# EAGLE design FindMe_Hub (EAGLE 9.0.1)

## Sheet 1 of 2
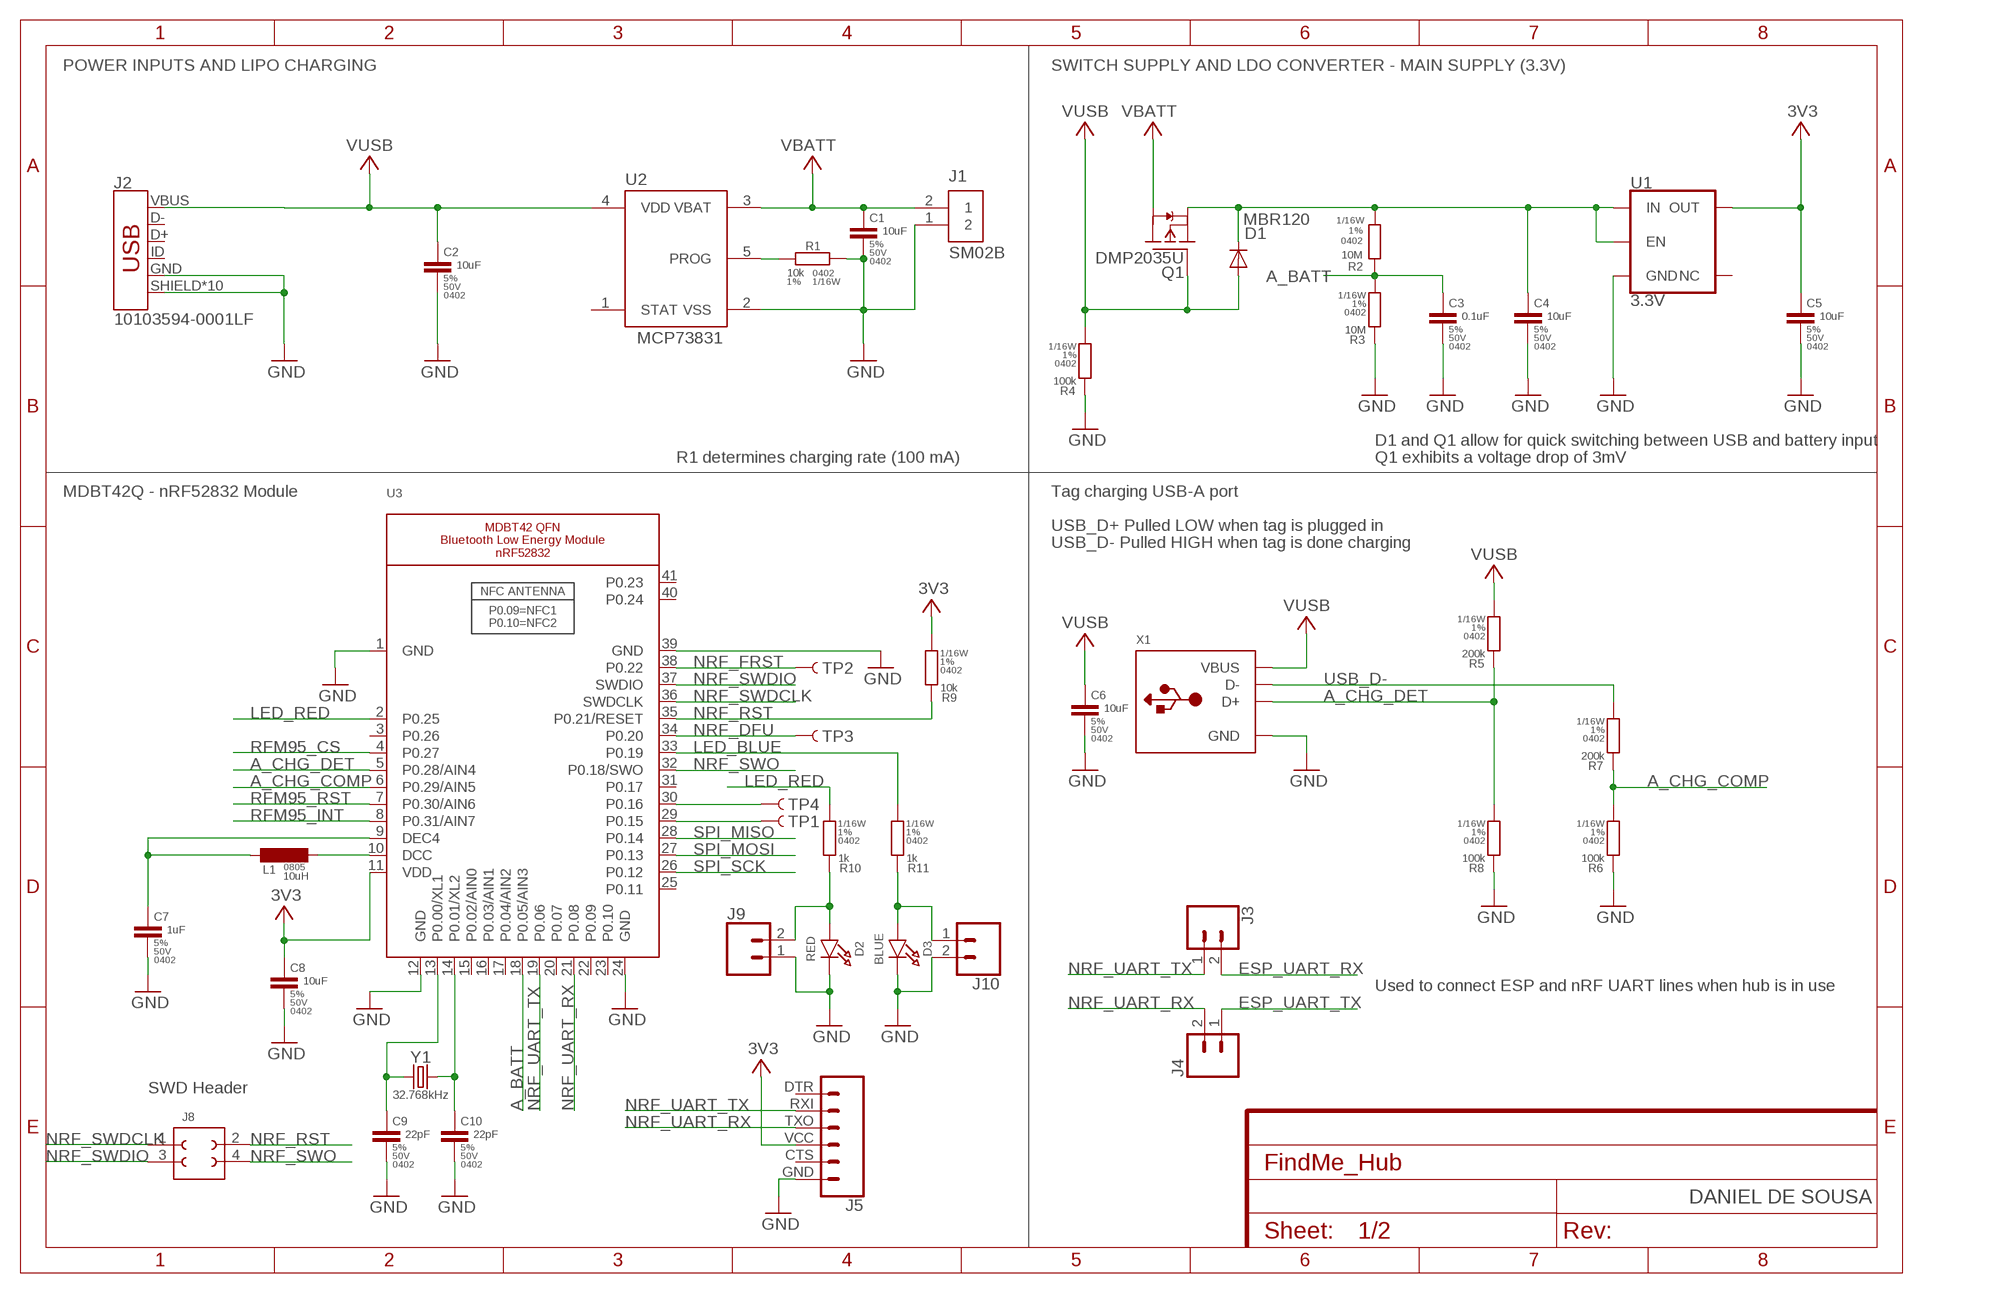
[diagram p0: schematic, sheet 1]

### Parts
C1  10uF  C-EUC0402_MURATA_GRM15-GJM15  [C0402_MURATA_GRM15-GJM15]
C2  10uF  C-EUC0402_MURATA_GRM15-GJM15  [C0402_MURATA_GRM15-GJM15]
C3  0.1uF  C-EUC0402_MURATA_GRM15-GJM15  [C0402_MURATA_GRM15-GJM15]
C4  10uF  C-EUC0402_MURATA_GRM15-GJM15  [C0402_MURATA_GRM15-GJM15]
C5  10uF  C-EUC0402_MURATA_GRM15-GJM15  [C0402_MURATA_GRM15-GJM15]
C6  10uF  C-EUC0402_MURATA_GRM15-GJM15  [C0402_MURATA_GRM15-GJM15]
C7  1uF  C-EUC0402_MURATA_GRM15-GJM15  [C0402_MURATA_GRM15-GJM15]
C8  10uF  C-EUC0402_MURATA_GRM15-GJM15  [C0402_MURATA_GRM15-GJM15]
C9  22pF  C-EUC0402_MURATA_GRM15-GJM15  [C0402_MURATA_GRM15-GJM15]
C10  22pF  C-EUC0402_MURATA_GRM15-GJM15  [C0402_MURATA_GRM15-GJM15]
D1  MBR120  AS-ITM-00111  [SOD-123FL]
D2  RED  LED0805_NOOUTLINE  [CHIPLED_0805_NOOUTLINE]
D3  BLUE  LED0805_NOOUTLINE  [CHIPLED_0805_NOOUTLINE]
J1  SM02B  AS-ITM-00231  [JST_SH_2X1]
J2  10103594-0001LF  USB_MICRO-B_HALF_PTH_MILL  [USB-MICROB-PTH-MILL]
J3  CONN_02  [1X02]
J4  CONN_02  [1X02]
J5  6_PIN_SERIAL_CABLEPTH  [FTDI_BASIC]
J8  610X0421121  [610X0421121]
J9  CONN_02  [1X02]
J10  CONN_02  [1X02]
L1  10uH  LQM21PN1R0MC0D  [L0805_MURATA_LQM21]
Q1  DMP2035U  AS-ITM-00024  [SOT23]
R1  10k  CRCW040210K0FKED  [R0402_VISHAY_CRCW0402]
R2  10M  CRCW04021M00FKED  [R0402_VISHAY_CRCW0402]
R3  10M  CRCW04021M00FKED  [R0402_VISHAY_CRCW0402]
R4  100k  CRCW04021M00FKED  [R0402_VISHAY_CRCW0402]
R5  200k  CRCW04021M00FKED  [R0402_VISHAY_CRCW0402]
R6  100k  CRCW04021M00FKED  [R0402_VISHAY_CRCW0402]
R7  200k  CRCW04021M00FKED  [R0402_VISHAY_CRCW0402]
R8  100k  CRCW04021M00FKED  [R0402_VISHAY_CRCW0402]
R9  10k  CRCW040210K0FKED  [R0402_VISHAY_CRCW0402]
R10  1k  CRCW040210K0FKED  [R0402_VISHAY_CRCW0402]
R11  1k  CRCW040210K0FKED  [R0402_VISHAY_CRCW0402]
TP1  TEST-POINT3X5  [PAD.03X.05]
TP2  TEST-POINT3X5  [PAD.03X.05]
TP3  TEST-POINT3X5  [PAD.03X.05]
TP4  TEST-POINT3X5  [PAD.03X.05]
U1  3.3V  V_REG_AP2112K-3.3V  [SOT23-5]
U2  MCP73831  AS-ITM-00136  [SOT-23]
U3  NRF52832_MODULE_MDBT42  [BLE_MODULE_RAYTAC_MDBT42]
X1  USB_TYPEAPTHFML  [USB_HOST-PTH]
Y1  32.768kHz  CRYSTAL-32.768KHZSMD-3.2X1.5  [CRYSTAL-SMD-3.2X1.5MM]

### Nets
+3V3: C5.1 C8.1 J5.VCC R9.2 U1.5(OUT) U3.11(VDD) ; supply symbol labelled 3V3 ; also sheet 2
A_BATT: C3.1 R2.1 R3.2 U3.18(P0.05/AIN3)
A_CHG_COMP: R6.2 R7.1 U3.6(P0.29/AIN5)
A_CHG_DET: R5.1 R8.2 U3.5(P0.28/AIN4) X1.D+
ESP_UART_RX: J3.2 ; also sheet 2
ESP_UART_TX: J4.1 ; also sheet 2
GND: C1.2 C2.2 C3.2 C4.2 C5.2 C6.2 C7.2 C8.2 C9.2 C10.2 D2.C D3.C J1.1 J2.GND J2.SHIELD J2.SHIELD2(SHIELD) J2.SHIELD3(SHIELD) J2.SHIELD4(SHIELD) J2.SHIELD5(SHIELD) J2.SHIELD6(SHIELD) J2.SHIELD7(SHIELD) J2.SHIELD8(SHIELD) J2.SHIELD9(SHIELD) J2.SHIELD10(SHIELD) J5.GND J9.1 J10.2 R1.1 R3.1 R4.1 R6.1 R8.1 U1.2(GND) U2.2(VSS) U3.1(GND) U3.12(GND) U3.24(GND) U3.39(GND) X1.GND ; also sheet 2
LED_BLUE: R11.2 U3.33(P0.19)
LED_RED: R10.2 U3.2(P0.25)
N$1: C9.1 U3.13(P0.00/XL1) Y1.P$1
N$2: R1.2 U2.5(PROG)
N$3: C4.1 D1.C Q1.E(S) R2.2 U1.1(IN) U1.3(EN)
N$4: C10.1 U3.14(P0.01/XL2) Y1.P$2
N$5: TP4.P$1 U3.30(P0.16)
N$6: TP1.P$1 U3.29(P0.15)
N$7: D2.A J9.2 R10.1
N$8: L1.P$2 U3.10(DCC)
N$9: C7.1 L1.P$1 U3.9(DEC4)
N$11: D3.A J10.1 R11.1
NRF_DFU: TP3.P$1 U3.34(P0.20)
NRF_FRST: TP2.P$1 U3.38(P0.22)
NRF_RST: J8.2 R9.1 U3.35(P0.21/RESET)
NRF_SWDCLK: J8.1 U3.36(SWDCLK)
NRF_SWDIO: J8.3 U3.37(SWDIO)
NRF_SWO: J8.4 U3.32(P0.18/SWO)
NRF_UART_RX: J4.2 J5.TXO U3.21(P0.08)
NRF_UART_TX: J3.1 J5.RXI U3.19(P0.06)
RFM95_CS: U3.4(P0.27) ; also sheet 2
RFM95_INT: U3.8(P0.31/AIN7) ; also sheet 2
RFM95_RST: U3.7(P0.30/AIN6) ; also sheet 2
SPI_MISO: U3.28(P0.14) ; also sheet 2
SPI_MOSI: U3.27(P0.13) ; also sheet 2
SPI_SCK: U3.26(P0.12) ; also sheet 2
USB_D-: R7.2 X1.D-
VBATT: C1.1 J1.2 Q1.C(D) U2.3(VBAT)
VUSB: C2.1 C6.1 D1.A J2.VBUS Q1.B(G) R4.2 R5.2 U2.4(VDD) X1.VBUS ; also sheet 2
Unconnected: J2.D+ J2.D- J2.ID J5.CTS J5.DTR U1.4(NC) U2.1(STAT) U3.3(P0.26) U3.15(P0.02/AIN0) U3.16(P0.03/AIN1) U3.17(P0.04/AIN2) U3.20(P0.07) U3.22(P0.09) U3.23(P0.10) U3.25(P0.11) U3.31(P0.17) U3.40(P0.24) U3.41(P0.23)

### Notes on the sheet
- POWER INPUTS AND LIPO CHARGING | SWITCH SUPPLY AND LDO CONVERTER - MAIN SUPPLY (3.3V)
- D1 and Q1 allow for quick switching between USB and battery input
- R1 determines charging rate (100 mA) | Q1 exhibits a voltage drop of 3mV
- MDBT42Q - nRF52832 Module | Tag charging USB-A port
- USB_D+ Pulled LOW when tag is plugged in
- USB_D- Pulled HIGH when tag is done charging
- Used to connect ESP and nRF UART lines when hub is in use
- SWD Header
- DANIEL DE SOUSA

## Sheet 2 of 2
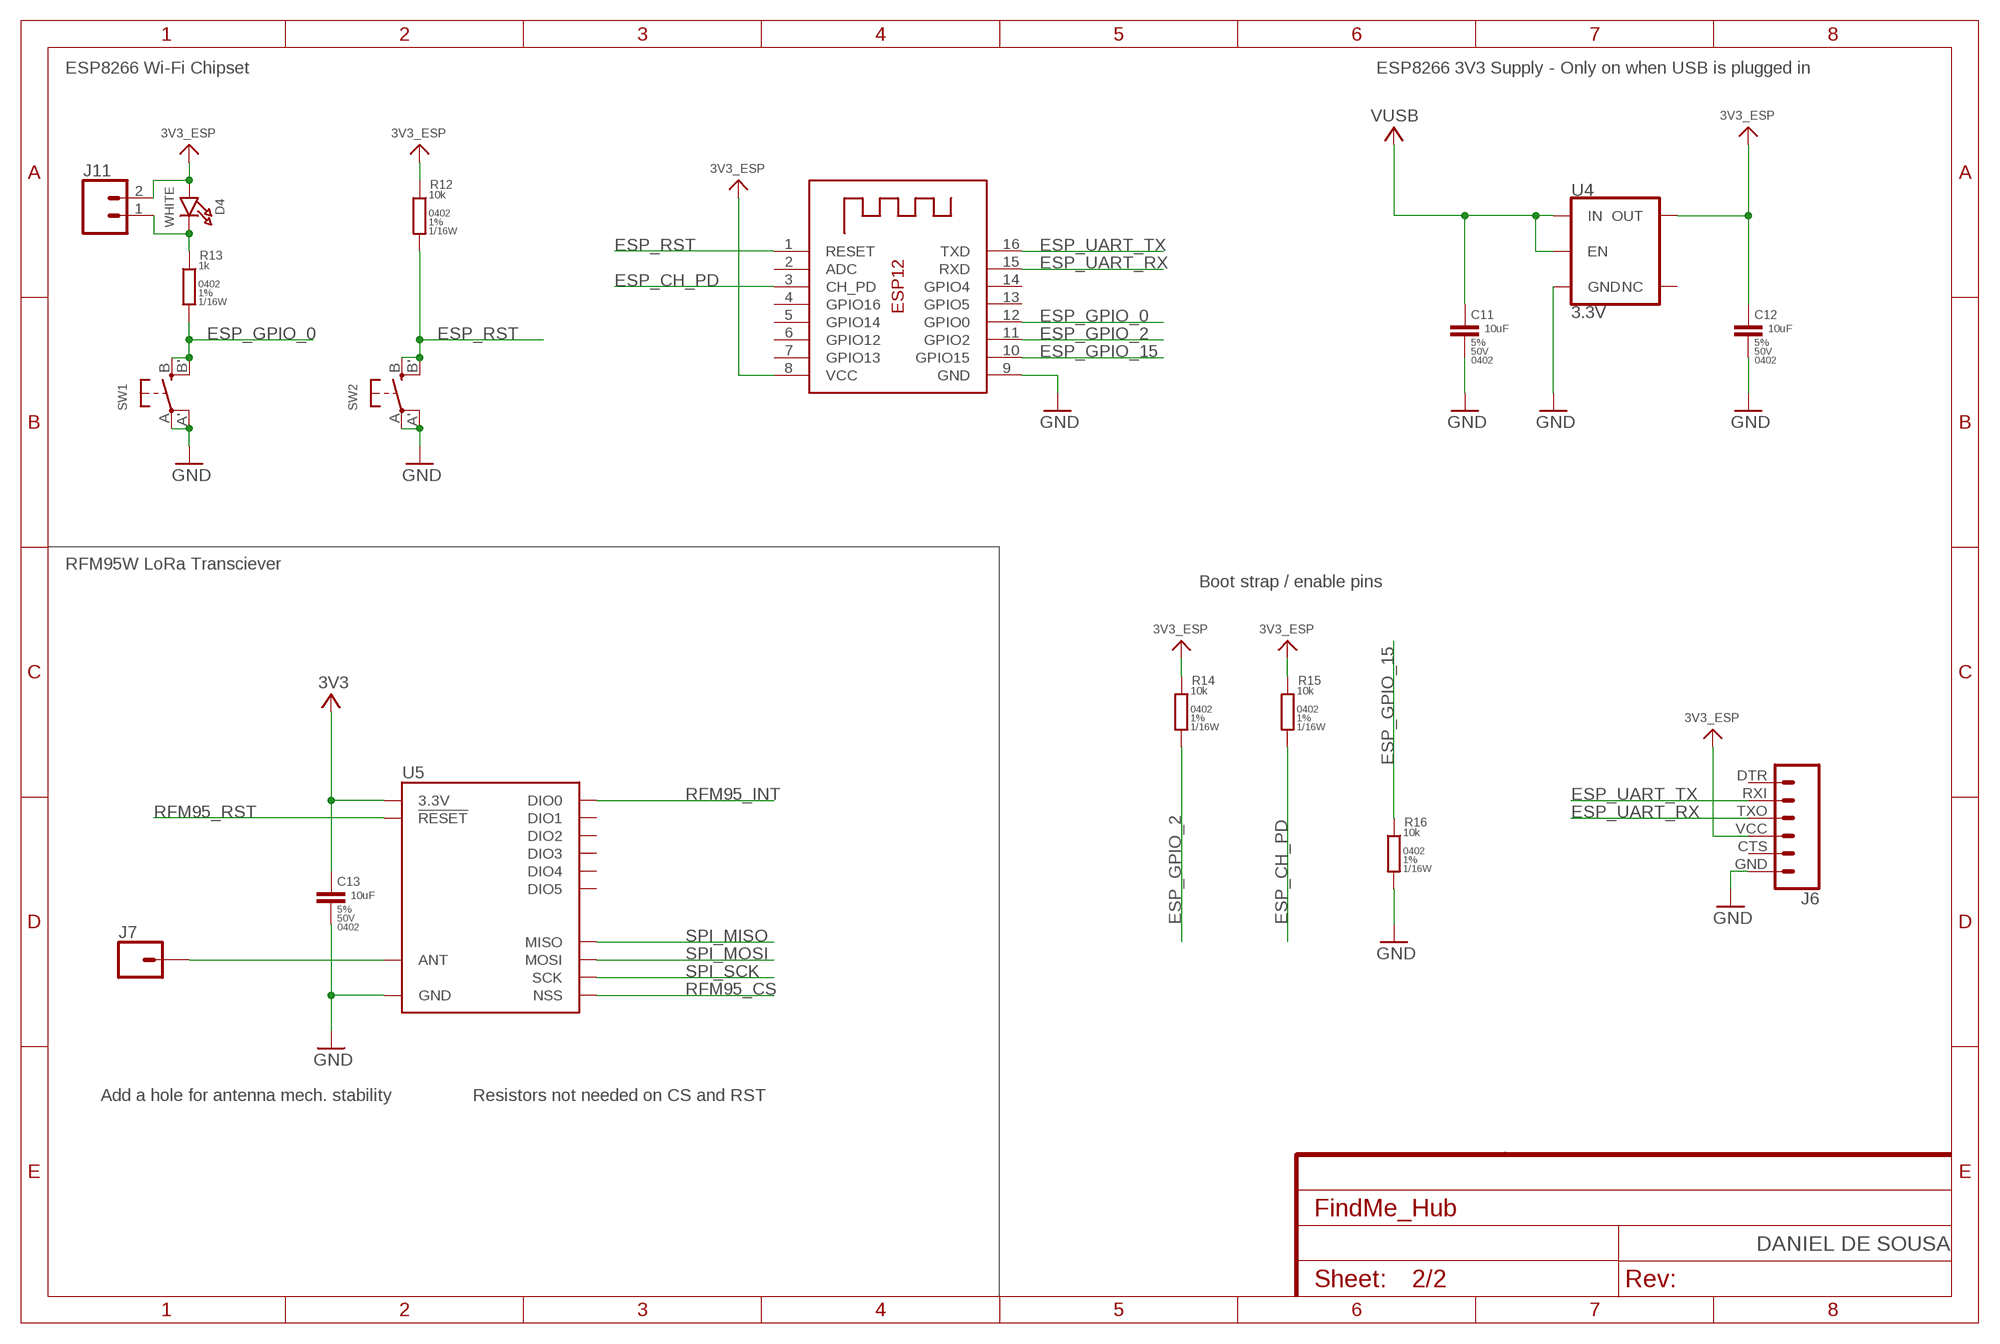
[diagram p1: schematic, sheet 2]

### Parts
C11  10uF  C-EUC0402_MURATA_GRM15-GJM15  [C0402_MURATA_GRM15-GJM15]
C12  10uF  C-EUC0402_MURATA_GRM15-GJM15  [C0402_MURATA_GRM15-GJM15]
C13  10uF  C-EUC0402_MURATA_GRM15-GJM15  [C0402_MURATA_GRM15-GJM15]
D4  WHITE  LED0805_NOOUTLINE  [CHIPLED_0805_NOOUTLINE]
J6  6_PIN_SERIAL_CABLEPTH  [FTDI_BASIC]
J7  CONN_01PTH_NO_SILK_YES_STOP  [1X01_NO_SILK]
J11  CONN_02  [1X02]
R12  10k  CRCW04021M00FKED  [R0402_VISHAY_CRCW0402]
R13  1k  CRCW04021M00FKED  [R0402_VISHAY_CRCW0402]
R14  10k  CRCW04021M00FKED  [R0402_VISHAY_CRCW0402]
R15  10k  CRCW04021M00FKED  [R0402_VISHAY_CRCW0402]
R16  10k  CRCW04021M00FKED  [R0402_VISHAY_CRCW0402]
SW1  SWITCH_TACT_SMT4.6X2.8  [BTN_KMR2_4.6X2.8]
SW2  SWITCH_TACT_SMT4.6X2.8  [BTN_KMR2_4.6X2.8]
U4  3.3V  V_REG_AP2112K-3.3V  [SOT23-5]
U5  RFM95W  [RFM95/96/97/98W]
X2  ESP-12  [ESP-12]

### Nets
+3V3: C13.1 U5.3.3V ; supply symbol labelled 3V3 ; also sheet 1
ESP_CH_PD: R15.2 X2.3(CH_PD)
ESP_GPIO_0: R13.2 SW1.B'(S1) SW1.B(S) X2.12(GPIO0)
ESP_GPIO_2: R14.2 X2.11(GPIO2)
ESP_GPIO_15: R16.1 X2.10(GPIO15)
ESP_RST: R12.2 SW2.B'(S1) SW2.B(S) X2.1(RESET)
ESP_UART_RX: J6.TXO X2.15(RXD) ; also sheet 1
ESP_UART_TX: J6.RXI X2.16(TXD) ; also sheet 1
GND: C11.2 C12.2 C13.2 J6.GND R16.2 SW1.A'(P1) SW1.A(P) SW2.A'(P1) SW2.A(P) U4.2(GND) U5.GND@1(GND) U5.GND@2(GND) U5.GND@3(GND) X2.9(GND) ; also sheet 1
N$12: J7.1 U5.ANT
N$14: D4.C J11.1 R13.1
RFM95_CS: U5.NSS ; also sheet 1
RFM95_INT: U5.DIO0 ; also sheet 1
RFM95_RST: U5.!RESET ; also sheet 1
SPI_MISO: U5.MISO ; also sheet 1
SPI_MOSI: U5.MOSI ; also sheet 1
SPI_SCK: U5.SCK ; also sheet 1
VCCIO: C12.1 D4.A J6.VCC J11.2 R12.1 R14.1 R15.1 U4.5(OUT) X2.8(VCC) ; supply symbol labelled 3V3_ESP
VUSB: C11.1 U4.1(IN) U4.3(EN) ; also sheet 1
Unconnected: J6.CTS J6.DTR U4.4(NC) U5.DIO1 U5.DIO2 U5.DIO3 U5.DIO4 U5.DIO5 X2.2(ADC) X2.4(GPIO16) X2.5(GPIO14) X2.6(GPIO12) X2.7(GPIO13) X2.13(GPIO5) X2.14(GPIO4)

### Notes on the sheet
- ESP8266 Wi-Fi Chipset | ESP8266 3V3 Supply - Only on when USB is plugged in
- RFM95W LoRa Transciever
- Boot strap / enable pins
- Add a hole for antenna mech. stability | Resistors not needed on CS and RST
- DANIEL DE SOUSA

## Library data of the parts
C1-C13 = CAPACITOR:C-EU: CAPACITOR, European symbol; PACKAGE: 0402; RATING: 50V; TOLERANCE: 5%
D1 = tinycircuits:AS-ITM-00111: DIODE SCHOTTKY 20V 1A SOD123L; PARTNO: AS-ITM-00111; PNPROTATION: 0; VALUE: MBR120VLSFT1G
D2-D4 = microbuilder:LED: LED 0603 - 0603 Surface Mount Package 2mA: Green LED - Low Power (3.9mcd, 2ma, 1.7Vf) - Digikey: 475-2709-2-ND Orange LED - Low Power (9.8mcd, 2ma, 1.8Vf) - Digikey: 475-1194-2-ND Red LED - Low Power (5mcd, 2ma, 1.8Vf) - Digikey: 475-1195-2-ND Yellow LED - Low Power (7mcd, 2ma, 1.8Vf) - Digikey: 475-1196-2-ND 5mA: Blue LED - Low Power (17mcd, 5ma, 2.9Vf) - Digikey: LNJ937W8CRACT-ND 0805 - 0805 Surface Mount Package 2mA: Red LED (8.8mcd, 2mA, 1.8Vf, Clear) - Low Power [Digikey: 475-2510-1-ND] Green LED (5mcd, 2mA, 1.8Vf, Clear) - Low Power [Digikey: 475-2730-1-ND] Yellow LED (11.3mcd, 2mA, 1.8Vf, Clear) - Low Power [Digikey: 475-2555-1-ND] 20mA: Red LED (104mcd, 20mA, Diffused) - LS R976 [Digikey: 475-1278-6-ND] Red LED (12mcd, 20mA, 2.0Vf, Clear) - APT2012EC [Digikey: 754-1128-1-ND] Green LED (15mcd, 20mA, 2.2Vf, Clear) - APT2012GC [Digikey: 754-1131-1-ND] Orange LED (160mcd, 20mA, 2.1Vf, Clear) - APT2012SECK [Digikey: 754-1130-1-ND] 1206 - 1206 Surface Mount Package Green LED (26mcd, 20mA, Diffused) - LG N971 [Digikey: 475-1407-6-ND] Red LED (15mcd, 20mA, Diffused) - LH N974 [Digikey: 475-1416-6-ND] Cree - Cree High-Power Surface Mount LEDs XPEBWT-L1-0000-00D50 - White 111lm 350mA 2.9Vf 6200K 110° XTEAWT-00-0000-00000LEE3 - White 114lm 350mA 2.85Vf 5000K 115° Everlight - Everlight 45-21 Series Surface Mount LEDs 45-21/QK2C-B2832AC2CB2/2T - Warm White 2000mcd 20mA 3.25Vf 3050K 120° 45-21/LK2C-B38452C4CB2/2T - Nuetral White 2000mcd 20mA 3.25Vf 4150K 120° 45-21/LK2C-B50634C6CB2/2T - Cold White 2200mcd 20mA 3.25Vf 5650K 120° PLCC2 Reverse Mount LS T77K-J1L2-1-0-2-R18-Z - Red 11.25mcd 2mA 1.8Vf 630nm 120° LO T77K-L1M2-24-Z - Orange 19.6mcd 2mA 1.8Vf 606nm 120° LY T77K-K2M1-26-Z - Yellow 15.7mcd 2mA 1.8Vf 587nm 120°
J1 = tinycircuits:AS-ITM-00231: CONN HEADER SH 2POS SIDE 1MM; PARTNO: AS-ITM-00231; PNPROTATION: 180; VALUE: SM02B-SRSS-TB(LF)(SN)
J2 = SparkFun-Connectors:USB_MICRO-B: USB Type Micro-B Connector Male/female and PTH/SMT variants SparkFun Products: SparkFun microB USB Breakout <https://www.sparkfun.com/products/12035> SparkFun USB microB Plug Breakout <https://www.sparkfun.com/products/10031> SparkFun ESP8266 Thing <https://www.sparkfun.com/products/13231>; PROD_ID: CONN-13711
J3 J4 J9-J11 = SparkFun-Connectors:CONN_02: Multi connection point. Often used as Generic Header-pin footprint for 0.1 inch spaced/style header connections On any of the 0.1 inch spaced packages, you can populate with these: Break Away Headers - Straight <https://www.sparkfun.com/products/116> (PRT-00116) Break Away Male Headers - Right Angle <https://www.sparkfun.com/products/553> (PRT-00553) Female Headers <https://www.sparkfun.com/products/115> (PRT-00115) Break Away Headers - Machine Pin <https://www.sparkfun.com/products/117> (PRT-00117) Break Away Female Headers - Swiss Machine Pin <https://www.sparkfun.com/products/743> (PRT-00743) For SCREWTERMINALS and SPRING TERMINALS visit here: Screw Terimnals on SparkFun.com <https://www.sparkfun.com/search/results?term=Screw+Terminals> (5mm/3.5mm/2.54mm spacing) This device is also useful as a general connection point to wire up your design to another part of your project. Our various solder wires solder well into these plated through hole pads. Hook-Up Wire - Assortment (Stranded, 22 AWG) <https://www.sparkfun.com/products/11375> (PRT-11375) Hook-Up Wire - Assortment (Solid Core, 22 AWG) <https://www.sparkfun.com/products/11367> (PRT-11367) View the entire wire category on our website here <https://www.sparkfun.com/categories/141> Special notes: Molex polarized connector foot print use with: PRT-08233 with associated crimp pins and housings. 2.54_SCREWTERM for use with PRT-10571. 3.5mm Screw Terminal footprints for PRT-08084 5mm Screw Terminal footprints for use with PRT-08432
J5 J6 = SparkFun-Connectors:6_PIN_SERIAL_CABLE: 6-pin header connection for use with the "FTDI BASIC" pinout - CABLE SIDE. Also known as "Arduino Serial Program Header". This is used on a design to provide a 6-pin connection point for serial communication usually from a USB cable (D+/D-) to these headers (RX/TX). It also has the remaining pins necessary for programming in the Arduino evironment (DTR, GND, and sometimes VCC). Note, this device has "CABLE" in the name. It is intended to be used on a design that usually lives on the end of your USB cable and prvides the converter chip (FTDI232 or FTDI231x) to commnicate serial RX/TX. The "sister" device, named "TARGET" is inteneded to be used on a design that contains a target micro-controller that you wish to program. You can populate with some of these: Female Headers <https://www.sparkfun.com/products/115> (PRT-00115) For reference (or to suit your programming needs) check out these designs: SparkFun FTDI Basic Breakout - 5V <https://www.sparkfun.com/products/9716> (DEV-09716) SparkFun FTDI Basic Breakout - 3.3V <https://www.sparkfun.com/products/9873> (DEV-09873) SparkFun FTDI SmartBasic <https://www.sparkfun.com/products/12935> (DEV-12935) SparkFun Beefy 3 - FTDI Basic Breakout <https://www.sparkfun.com/products/13746> (DEV-13746)
J7 = SparkFun-Connectors:CONN_01: Single connection point. Often used as Generic Header-pin footprint for 0.1 inch spaced/style header connections On any of the 0.1 inch spaced packages, you can populate with these: Break Away Headers - Straight <https://www.sparkfun.com/products/116> (PRT-00116) Break Away Male Headers - Right Angle <https://www.sparkfun.com/products/553> (PRT-00553) Female Headers <https://www.sparkfun.com/products/115> (PRT-00115) Break Away Headers - Machine Pin <https://www.sparkfun.com/products/117> (PRT-00117) Break Away Female Headers - Swiss Machine Pin <https://www.sparkfun.com/products/743> (PRT-00743) This device is also useful as a general connection point to wire up your design to another part of your project. Our various solder wires solder well into these plated through hole pads. Hook-Up Wire - Assortment (Stranded, 22 AWG) <https://www.sparkfun.com/products/11375> (PRT-11375) Hook-Up Wire - Assortment (Solid Core, 22 AWG) <https://www.sparkfun.com/products/11367> (PRT-11367) View the entire wire category on our website here <https://www.sparkfun.com/categories/141> Special notes: SMTSO-256-ET is a "flush mount" nut for a 4-40 screw. We mostly use this on specialty testbeds; it is a nice way to connect hardware to your PCB at an adjustable hieght. Also note, the SNAP packages are for using a snappable style connector. We sell a baggie of snaps and they are also used on two LilyPad designs: Snap Assortment - 30 pack (male and female) <https://www.sparkfun.com/products/11347> (DEV-11347) LilyPad Arduino SimpleSnap <https://www.sparkfun.com/products/10941> (DEV-10941) LilyPad SimpleSnap Protoboard <https://www.sparkfun.com/products/10940> (DEV-10940)
J8 = Board-to-Board (rev18a):610X0421121: WR-PHD 2.54mm Dual SMT Pin Header, 6 Pins =>Code : Con_BTB_PHD_2.54_2_610x0621121(packageing:x = 0: Tube x = 3: Tape & Reel with Cap; 300 pcs/Reel) <http://katalog.we-online.de/media/images/eican/Con_BTB_PHD_2.54_2_6100xx21121_pf2.jpg> 6100xx21121 Details see: http://katalog.we-online.de/en/em/610_0xx_211_21 6103xx21121 Details see: http://katalog.we-online.de/en/em/PHD_2_54_SMT_DUAL_PIN_HEADER_REEL_6103XX21121 2014 (C) Würth Elektronik
L1 = INDUCTOR:LQM21PN1R0MC0D; PACKAGE: 0805; RATING: 800mA; TOLERANCE: 20%; VALUE: 1uH
Q1 = tinycircuits:AS-ITM-00024: P-Channel MOSFET SOT-23; PARTNO: AS-ITM-00024; PNPROTATION: 0
R1 R9 = resistor:CRCW040210K0FKED; PACKAGE: 0402; RATING: 1/16W; TOLERANCE: 1%
R2-R8 R12-R16 = resistor:CRCW04021M00FKED; PACKAGE: 0402; RATING: 1/16W; TOLERANCE: 1%; VALUE: 1M
R10 R11 = resistor:CRCW040210K0FKED; PACKAGE: 0402; RATING: 1/16W; TOLERANCE: 1%; VALUE: 10k
SW1 SW2 = ESP8266:SWITCH_TACT_SMT: SMT Tact Switches 6x6mm - Digikey: P12940SCT-ND KMR2 (4.6x2.8mm) - Digikey: 401-1426-1-ND EVQ-PQHB55 - Light Touch, 160GF (4.5x4.5mm) - Digikey: P8090SCT-ND KMT0 - KMT021 NGJ LHS (etc.) IP68/Waterproof - Digikey: CKN10289CT-ND
TP1-TP4 = SparkFun-Connectors:TEST-POINT: SparkFun Test Points Bare copper test points for troubleshooting or In-Circuit-Testing. These are used by our Production team for verifying production board runs using pogo-pins on test beds. SparkFun Products: SparkFun LSM9DS1 Breakout <https://www.sparkfun.com/products/13284> SparkFun PSOC <https://www.sparkfun.com/products/13714> SparkFun Load Cell Amplifier <https://www.sparkfun.com/products/13879>
U1 U4 = SparkFun-IC-Power:V_REG_AP2112: AP2112 - 600mA CMOS LDO Regulator w/ Enable The AP2112 is CMOS process low dropout linear regulator with enable function, the regulator delivers a guaranteed 600mA (min.) continuous load current. Features Output Voltage Accuracy: ±1.5% Output Current: 600mA (Min.) Foldback Short Current Protection: 50mA Enable Function to Turn ON/OFF VOUT Low Dropout Voltage (3.3V): 250mV (Typ.) @IOUT=600mA Excellent Load Regulation: 0.2%/A (Typ.) Excellent Line Regulation: 0.02%/V (Typ.) Low Quiescent Current: 55μA (Typ.) Low Standby Current: 0.01μA (Typ.) Low Output Noise: 50μVRMS PSRR: 100Hz -65dB, 1kHz -65dB OTSD Protection Stable with 1.0μF Flexible Cap: Ceramic, Tantalum and Aluminum Electrolytic Operation Temperature Range: -40°C to 85°C ESD: MM 400V, HBM 4000V; PROD_ID: VREG-12457
U2 = tinycircuits:AS-ITM-00136: IC CONTROLLER LI-ION 4.2V SOT23-5; PARTNO: AS-ITM-00136; PNPROTATION: 270
U3 = nRF52832:NRF52832_MODULE_MDBT42: MDBT42 - BLE Module (nRF52832 QFN) VDD: 1.7-3.6V
U5 = SparkFun-RF:RFM95W: RFM95/96/97/98 The RFM95/96/97/98(W) transceivers feature the LoRaTM long range modem that provides ultra-long range spread spectrum communication and high interference immunity whilst minimising current consumption. These devices also support high performance (G)FSK modes for systems including WMBus, IEEE802.15.4g. The RFM95/96/97/98(W) deliver exceptional phase noise, selectivity, receiver linearity and IIP3 for significantly lower current consumption than competing devices Datasheet <http://www.hoperf.com/upload/rf/RFM95_96_97_98W.pdf>; PROD_ID: IC-13959
X1 = USB-A:USB_TYPEA: USB - Type A Connectors Male types stick out and are inserted into a PC or matching females parts (these are the connectors used on USB Memory Sticks, etc.). Female parts are generally used for USB Host and accept a male-type connector. SMT - 4UCON: 10017 PTHFML - Digikey: 609-1045-ND, 4UCon: 05241 PCB - Use 2.0mm thick PCBs with this footprint
X2 = ESP8266:ESP-12
Y1 = SparkFun-Clocks:CRYSTAL-32.768KHZ: 32.768kHz Crystal Frequency: 32.768kHz Frequency Stability: ±20ppm Load Capacitance: 12.5pF (PTH-2X6 & SMD-3.2X1.5), 6pF (SMD-2X6) SparkFun Products: SparkFun BigTime Watch Kit <https://www.sparkfun.com/products/11734> SparkFun nRF52832 Breakout <https://www.sparkfun.com/products/13990> SparkFun Real Time Clock Module <https://www.sparkfun.com/products/12708>; PROD_ID: XTAL-13062

## Board
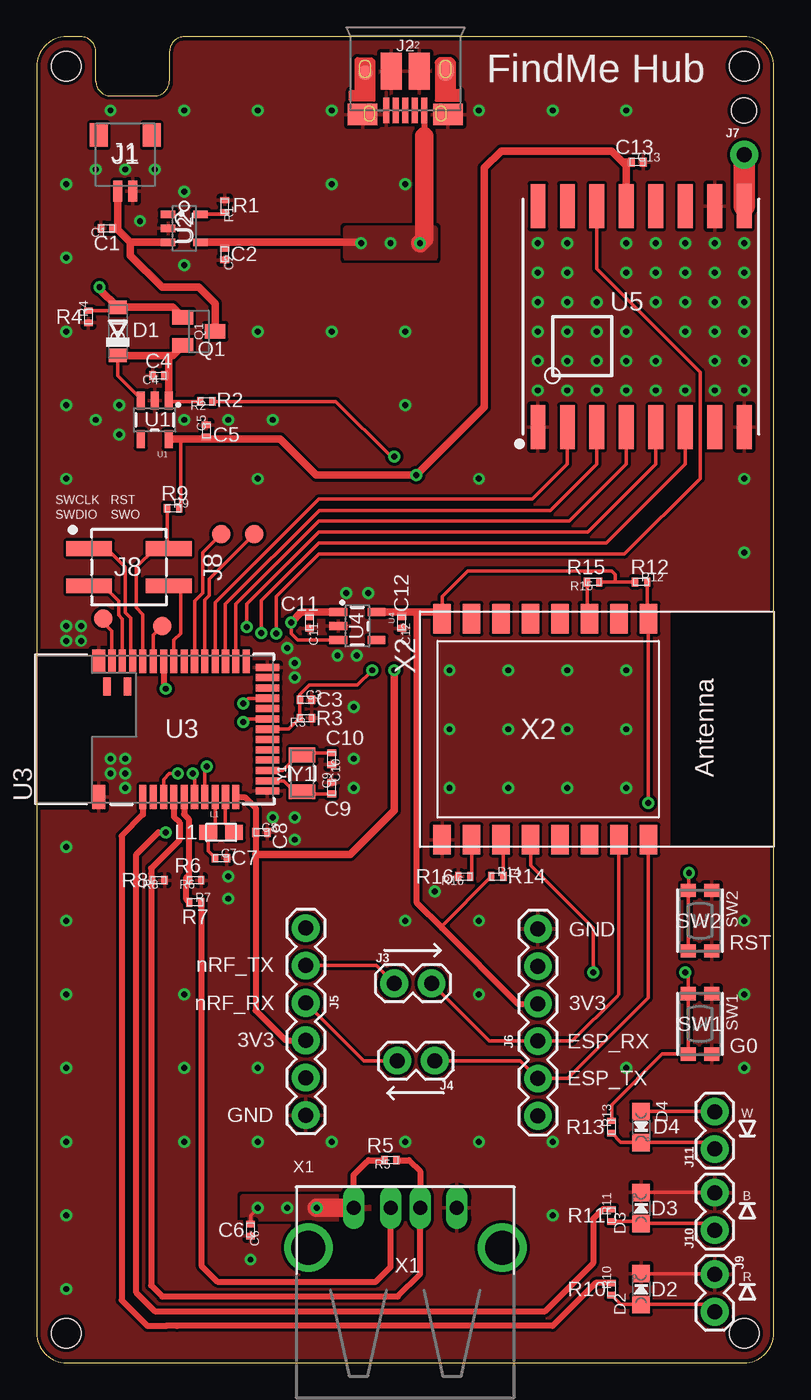
[diagram p2: board, top side]
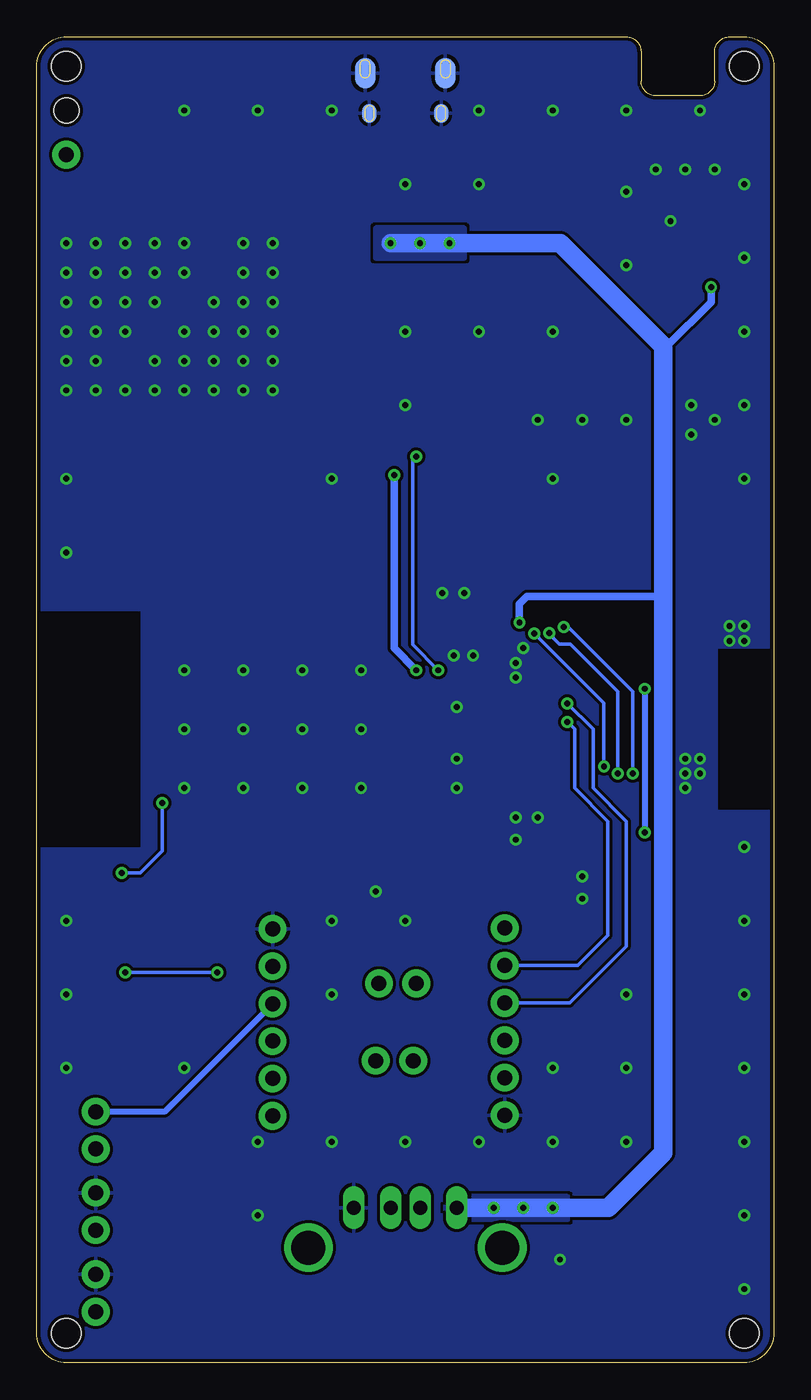
[diagram p3: board, bottom side, seen from below]

Size 50 x 90 mm. Coordinates in mm from the lower left corner, seen from the top.
Outline: 4,87 4,89 arc90 3,90 2,90 arc90 0,88 0,2 arc90 2,0 48,0 arc90 50,2 50,88 arc90 48,90 10,90 arc90 9,89 9,87 arc-90 8,86 5,86 arc-90 4,87
Copper layers (1*16): Top 0.035mm / dielectric 1.5mm / Bottom 0.035mm
Design rules "drc": minimum track width 8mil, minimum drill 15.5mil, track to track 8mil, track to pad 8mil, pad to pad 8mil, via to via 8mil, smd to smd 8mil, copper to edge 10mil, drill to drill 8mil, minimum pad ring 10mil, minimum via ring 8mil, stop-mask expansion 2mil, vias tented up to drill 20mil, thermal gap 10mil
Holes 2 mm at 2,2 48,2 2,88 48,88
Holes 1.7 mm at 48,85

### Footprints (pad centres in the part's own frame; a part is rotated, then mirrored left to right if it is on the bottom)
C0402_MURATA_GRM15-GJM15 = smd 0.45 x 0.6: 1 -0.4,0; 2 0.4,0
SOD-123FL = smd 0.914 x 1.219: A 1.638,0; C -1.638,0
CHIPLED_0805_NOOUTLINE = smd 1.2 x 1.2: A 0,-1.05; C 0,1.05
JST_SH_2X1 = smd 0.6 x 1.4: 1 -0.5,2.475; 2 0.5,2.475 | smd 1.2 x 1.6: PAD1 -1.8,-1.325; PAD2 1.8,-1.325
USB-MICROB-PTH-MILL = smd 0.4 x 1.75: D+ 0,0; D- -0.65,0; GND 1.3,0; ID 0.65,0; VBUS -1.3,0 | smd 2 x 1.46: SHIELD -2.9,0.275; SHIELD2 2.9,0.275 | smd 1.425 x 2.5: SHIELD3 -0.963,-2.675; SHIELD4 0.963,-2.675 | smd 1.4 x 2.1 bottom: SHIELD5 -2.731,-2.531; SHIELD7 2.729,-2.531 | smd 1 x 1: SHIELD6 2.7,-2.575 | smd 1.1 x 1.5: SHIELD8 -2.731,-2.731 | smd 1 x 1.3 bottom: SHIELD9 -2.43,0.195; SHIELD10 2.43,0.195
1X02 = drill 1.016 pad 1.88: 1 0,0; 2 2.54,0
FTDI_BASIC = drill 1.016 pad 1.88: CTS 10.16,0; DTR 0,0; GND 12.7,0; RXI 2.54,0; TXO 5.08,0; VCC 7.62,0
1X01_NO_SILK = drill 1.016 pad 1.88: 1 0,0
610X0421121 = smd 1 x 3.1: 1 -1.27,-2.7; 2 -1.27,2.7; 3 1.27,-2.7; 4 1.27,2.7
L0805_MURATA_LQM21 = smd 1.2 x 1: P$1 -0.875,0; P$2 0.875,0
SOT23 = smd 1 x 1.4: B -0.95,-1.1; C 0,1.1; E 0.95,-1.1
R0402_VISHAY_CRCW0402 = smd 0.425 x 0.6: 1 -0.412,0; 2 0.412,0
BTN_KMR2_4.6X2.8 = smd 0.9 x 1: A 2.05,0.8; A' -2.05,0.8; B 2.05,-0.8; B' -2.05,-0.8
PAD.03X.05 = smd 1.27 x 1.27: P$1 0,0
SOT23-5 = smd 0.55 x 1.2: 1 -0.95,-1.3; 2 0,-1.3; 3 0.95,-1.3; 4 0.95,1.3; 5 -0.95,1.3
SOT-23 = smd 0.5 x 1: 1 -0.95,-1.1; 2 0,-1.1; 3 0.95,-1.1; 4 0.95,1.1; 5 -0.95,1.1
BLE_MODULE_RAYTAC_MDBT42 = smd 1.6 x 0.9: 1 -4.6,3.8; 39 4.6,3.8 | smd 1.6 x 0.48: 2 -4.6,0.8; 3 -4.6,0.1; 4 -4.6,-0.6; 5 -4.6,-1.3; 6 -4.6,-2; 7 -4.6,-2.7; 8 -4.6,-3.4; 9 -4.6,-4.1; 10 -4.6,-4.8; 11 -4.6,-5.5; 25 4.6,-6.2; 26 4.6,-5.5; 27 4.6,-4.8; 28 4.6,-4.1; 29 4.6,-3.4; 30 4.6,-2.7; 31 4.6,-2; 32 4.6,-1.3; 33 4.6,-0.6; 34 4.6,0.1; 35 4.6,0.8; 36 4.6,1.5; 37 4.6,2.2; 38 4.6,2.9 | smd 0.48 x 1.6: 12 -4.2,-7.65; 13 -3.5,-7.65; 14 -2.8,-7.65; 15 -2.1,-7.65; 16 -1.4,-7.65; 17 -0.7,-7.65; 18 0,-7.65; 19 0.7,-7.65; 20 1.4,-7.65; 21 2.1,-7.65; 22 2.8,-7.65; 23 3.5,-7.65; 24 4.2,-7.65 | smd 1.2 x 0.5: 40 2.9,3.25; 41 2.9,1.85
RFM95/96/97/98W = smd 3 x 1: 3.3V 7.5,1; !RESET -7.5,-3; ANT 7.5,-7; DIO0 7.5,3; DIO1 7.5,5; DIO2 7.5,7; DIO3 7.5,-3; DIO4 7.5,-1; DIO5 -7.5,-5; GND@1 -7.5,7; GND@2 -7.5,-7; GND@3 7.5,-5; MISO -7.5,5; MOSI -7.5,3; NSS -7.5,-1; SCK -7.5,1
USB_HOST-PTH = drill 0.95 long: D+ 1,6.52; D- -1,6.52; GND 3.5,6.52; VBUS -3.5,6.52 | drill 2.3 pad 2.9: S1 -6.57,3.81; S2 6.57,3.81
ESP-12 = smd 2 x 1.2: 1 -7.5,4.5; 2 -7.5,2.5; 3 -7.5,0.5; 4 -7.5,-1.5; 5 -7.5,-3.5; 6 -7.5,-5.5; 7 -7.5,-7.5; 8 -7.5,-9.5; 9 7.5,-9.5; 10 7.5,-7.5; 11 7.5,-5.5; 12 7.5,-3.5; 13 7.5,-1.5; 14 7.5,0.5; 15 7.5,2.5; 16 7.5,4.5
CRYSTAL-SMD-3.2X1.5MM = smd 1 x 1.8: P$1 -1.25,0; P$2 1.25,0

### Placement (x,y rotation side)
C1  4.75,77 180 top
C2  12.75,75.25 270 top
C3  18.25,45 0 top
C4  8.25,67 180 top
C5  11.5,63.25 90 top
C6  14.5,9 270 top
C7  12.5,34.25 0 top
C8  15.25,36 0 top
C9  20,39 90 top
C10  20,41 270 top
C11  18.5,50.25 270 top
C12  24.75,50.25 270 top
C13  40.75,81.5 0 top
D1  5.5,70 90 top
D2  41,5 0 top
D3  41,10.5 0 top
D4  41,16 180 top
J1  6,82 180 top
J2  25,85 180 top
J3  24.25,25.75 0 top
J4  27,20.5 180 top
J5  18.25,29.5 270 top
J6  34,16.75 90 top
J7  48,82 0 top
J8  6.25,54 270 top
J9  46,6 270 top
J10  46,9 90 top
J11  46,14.5 90 top
L1  12.5,36 0 top
Q1  11,70 270 top
R1  12.75,78.5 270 top
R2  11.5,65.25 180 top
R3  18.25,43.75 180 top
R4  3.5,71 90 top
R5  24,13.75 180 top
R6  10.75,32.75 180 top
R7  10.75,31.25 0 top
R8  8.25,32.75 180 top
R9  9.25,58 0 top
R10  39,5 90 top
R11  39,10 90 top
R12  41,53 0 top
R13  39,16 90 top
R14  31.25,33 0 top
R15  37.75,53 180 top
R16  29,33 180 top
SW1  45,23 270 top
SW2  45,30 270 top
TP1  14.75,56.25 0 top
TP2  4.5,50.5 0 top
TP3  8.5,50 0 top
TP4  12.5,56.25 0 top
U1  8,64 180 top
U2  10,77 270 top
U3  8,43 90 top
U4  21.75,50 270 top
U5  41,71 90 top
X1  25,4 0 top
X2  37,43 270 top
Y1  18,40 90 top

### Tracks (layer width: path | path; a pad name or v marks a point on that pad's centre or on a via)
+3V3  (via drill 0.4)
  Top 0.254: C5.1 11.5,62.7 | R9.2 9.75,58.09 9.75,62.7
  Top 0.406: J5.VCC 16.88,21.88 14.85,23.91 14.85,34.5 C8.1 14.85,37.65 14.1,38.4 U3.11 | U5.3.3V 40.02,78.77 40.1,79.6 | v25.75,60.25 27.12,61.62
  Top 0.508: U1.5 9.75,62.7 11.5,62.7 16.5,62.7 18.95,60.25 v25.75,60.25 | 24.9,60.25 v25.75,60.25 | v25.75,60.25 30.38,64.88 30.38,80.75 30.38,81.12 31.5,82.25 31.75,82.25 32,82.25 39,82.25 39.75,81.5 | v24.25,47 24.25,37.5 21.25,34.5 14.85,34.5 | 40.05,78.8 40.02,78.77 | 39.75,81.5 40,81.25 U5.3.3V | 39.75,81.5 C13.1
  Bottom 0.508: v25.75,60.25 25.75,48.5 v24.25,47
A_BATT  (via drill 0.4)
  Top 0.254: R2.1 20.29,65.25 24.04,61.5 v24.25,61.5 | v22.75,47 21.75,46 18.5,46 17.85,45.35 C3.1 17.85,43.76 R3.2 17.09,43 U3.18
  Bottom 0.254: v22.75,47 24.5,48.75 24.5,61.25 v24.25,61.5
A_CHG_COMP
  Top 0.406: U3.6 10,37.22 10.3,36.92 10.3,32.79 R6.2 10.14,32.94 10.14,31.44 R7.1
A_CHG_DET
  Top 0.254: 7.75,32.84 R8.2 7.75,32.75
  Top 0.406: U3.5 9.3,37.06 9.69,36.67 9.69,35.5 7.75,33.56 7.75,33.2 7.75,32.75 7.75,5.25 8.5,4.5 24.5,4.5 26,6 X1.D+ 26,13 25.25,13.75 R5.1
ESP_CH_PD
  Top 0.254: R15.2 37.34,50.66 X2.3
ESP_GPIO_0  (via drill 0.4)
  Top 0.254: X2.12 33.5,33.75 37.75,29.5 v37.75,26.5 | v44,26.5 44.2,26.3 SW1.B' SW1.B 42.45,20.95 39,17.5 R13.2
  Bottom 0.254: v37.75,26.5 v44,26.5
ESP_GPIO_2
  Top 0.254: X2.11 31.66,35.34 R14.2
ESP_GPIO_15
  Top 0.254: X2.10 29.5,33.09 R16.1
ESP_RST  (via drill 0.4)
  Top 0.254: R12.2 41.41,50.59 X2.1 v41.5,38 | v44.25,33.25 44.25,32.1 SW2.B' SW2.B
  Bottom 0.254: v41.5,38 41.5,36.75 41.5,36 41.5,34.75 43,33.25 v44.25,33.25
ESP_UART_RX
  Top 0.254: J3.2 30.71,21.83 J6.TXO 36.33,21.83 39.38,24.88 39.5,25 X2.15
ESP_UART_TX
  Top 0.254: J4.1 32.79,20.5 J6.RXI 36.04,19.29 41.5,24.75 X2.16
GND  (via drill 0.4)
  Top 0.254: D3.C J10.2 | D2.C 45.95,6.05 J9.1
  other vias: 10,85 5,85 15,85 20,85 30,85 35,85 40,85 20,80 25,80 10,74.5 2,75 15,70 20,70 25,70 25,65 2,65 2,60 15,60 30,60 48,60 28,47 21.5,44.5 28,43 28,39 5,40 48,30 30,30 25,30 10,25 30,25 40,20 15,20 10,20 10,15 15,15 20,15 25,15 30,15 35,15 35,10 7,77.5 6,81 8,81 4,81 10,79.5 2,70 2,80 5.6,65 5.6,63 10,64 13,64 5,41 6,41 6,40 6,39 2,30 2,25 2,20 2,15 2,35 2,10 2,5 13,33 13,31.5 21.5,41 21.5,39 16,37 17.5,37 17.5,35.5 17,48.5 17.5,47.5 17.5,46.5 3,49 3,50 2,50 2,49 14.5,7 21.7,48 20.4,48 21,52.25 22.5,52.25 34,76 34,74 34,72 34,70 34,68 34,66 48,25 48,20 27,32 48,55 32,47 36,47 40,47 40,43 36,43 32,43 32,39 36,39 40,39 36,76 36,74 36,72 36,70 36,68 36,66 38,66 38,68 38,70 38,72 40,70 40,68 40,66 42,66 42,68 40,76 42,76 44,76 46,76 48,76 48,74 46,74 44,74 42,74 40,74 42,72 44,72 46,72 48,72 48,70 46,70 44,70 46,68 46,66 48,66 44,66 48,68 4,64 16,64
  pour Bottom (rank 3): -1,91 51,91 51,-1 -1,-1
  pour Top (rank 3): -2,92 52,92 52,-2 -2,-2
LED_BLUE  (via drill 0.4)
  Top 0.406: R11.2 38.41,10.41 37.75,9.75 37.75,6.75 34.5,3.5 8,3.5 6.75,4.75 6.75,34.5 8.25,36 v8.74,36 | v8.75,45.75 8.6,45.9 U3.33
  Bottom 0.406: v8.74,36 v8.75,36.01 v8.75,45.75
LED_RED
  Top 0.406: R10.2 37.91,5.41 35,2.5 9.5,2.5 8.75,2.5 7.5,2.5 5.75,4.25 5.75,35.75 7.2,37.2 U3.2
N$1
  Top 0.254: U3.13 16.75,39.5 17.5,38.75 Y1.P$1 18.15,38.6 C9.1
N$2
  Top 0.254: U2.5 12.61,77.95 R1.2
N$3
  Top 0.254: D1.C 5.5,67 7.05,65.45 U1.3 | U1.1 9,65.25 R2.2 | C4.1 8.95,67
  Top 0.406: U1.1 9,65.35 8.9,65.45 | 9,68.36 8.9,68.26
  Top 0.508: D1.C 9,68.36 | 9,68.36 9.21,68.36 Q1.E | U1.1 8.95,67 8.95,68.31 9,68.36
N$4
  Top 0.254: U3.14 16.7,40.2 17.75,41.25 | 17.75,41.25 Y1.P$2 | C10.1 17.9,41.4 17.75,41.25
N$5
  Top 0.254: U3.30 10.7,51.7 11.25,52.25 11.25,55 TP4.P$1
N$6
  Top 0.254: U3.29 11.4,51.75 11.71,52.06 11.71,53.21 TP1.P$1
N$7
  Top 0.254: R10.1 39.64,3.95 D2.A 45.51,3.95 J9.2
N$8
  Top 0.254: U3.10 12.8,36.58 L1.P$2
N$9
  Top 0.254: U3.9 12.1,36.48 L1.P$1 11.62,34.73 C7.1
N$11
  Top 0.254: R11.1 40.86,9.59 D3.A 45.55,9.45 J10.1
N$12
  Top 1.473: U5.ANT J7.1
N$14
  Top 0.254: R13.1 39.64,14.95 D4.C 45.55,14.95 J11.1
NRF_DFU
  Top 0.254: 8,47.7 U3.34 7.9,49.4 TP3.P$1
NRF_FRST
  Top 0.254: 5,47.7 U3.38 5.1,49.65 4.5,50.25 TP2.P$1
NRF_RST
  Top 0.254: R9.1 8.84,55.38 | 8.84,55.38 J8.2 8.02,55.27 6.75,54 6.75,51.25 7.2,50.8 U3.35 | 8.13,55.38 8.84,55.38
NRF_SWDCLK
  Top 0.254: J8.1 4.73,55.27 6,54 6,50.93 6.37,50.56 6.37,47.73 U3.36
NRF_SWDIO
  Top 0.254: U3.37 5.8,50.48 5.54,50.74 5.54,51.71 4.52,52.73 J8.3
NRF_SWO
  Top 0.254: 9.3,52.38 J8.4 9.18,52.5 9.75,52.5 9.75,49.5 9.3,49.05 U3.32
NRF_UART_RX  (via drill 0.4)
  Top 0.254: J5.TXO 22.17,20.5 J4.2 | 15.55,45 U3.21 14.35,45.1 v14,44.75
  Bottom 0.254: J5.TXO 13.83,24.42 10,28.25 10,36.75 12.25,39 12.25,43 v14,44.75
NRF_UART_TX  (via drill 0.4)
  Top 0.254: 15.52,43.57 U3.19 14.2,43.7 v14,43.5 | J5.RXI 23.04,26.96 J3.1
  Bottom 0.254: J5.RXI 13.29,26.96 11.25,29 11.25,36.75 13.5,39 13.5,43 v14,43.5
RFM95_CS  (via drill 0.4)
  Top 0.254: U5.NSS 42,61 37.38,56.38 19.12,56.38 14.25,51.5 14.25,49.97 v14.23,49.95 | U3.4 8.6,39.6 9,40 v9.56,40
  Bottom 0.254: 10.04,46.04 | 10.04,46.04 13.95,49.95 v14.23,49.95 | 10.04,46.04 9.65,45.65 9.56,45.56 v9.56,40
RFM95_INT  (via drill 0.4)
  Top 0.254: 11.5,38.5 U3.8 11.4,40.36 v11.52,40.48 | U5.DIO0 38,74.25 45,67.25 45,60 39.88,54.88 19.12,54.88 16.25,52 v16.25,49.5
  Bottom 0.254: v16.25,49.5 15.96,49.21 11.88,45.12 11.52,44.77 v11.52,40.48
RFM95_RST  (via drill 0.4)
  Top 0.254: U5.!RESET 44,61 38.62,55.62 19.12,55.62 15.23,51.73 v15.23,49.52 | U3.7 10.7,39.87 v10.57,40
  Bottom 0.254: v15.23,49.52 15.25,49.5 14.96,49.21 14.54,48.79 13.79,48.79 11.04,46.04 10.57,45.57 v10.57,40
SPI_MISO
  Top 0.254: U3.28 12.1,51.6 19.12,58.62 33.62,58.62 36,61 U5.MISO
SPI_MOSI
  Top 0.254: 12.93,47.73 U3.27 12.8,51.5 19.15,57.85 34.85,57.85 38,61 U5.MOSI
SPI_SCK
  Top 0.254: 13.63,47.73 U3.26 13.5,51.5 19.12,57.12 36.12,57.12 40,61 U5.SCK
USB_D-
  Top 0.406: R7.2 11.16,6.59 12.25,5.5 23,5.5 24,6.5 X1.D-
VBATT
  Top 0.254: C1.1 5.4,77 5.5,76.9
  Top 0.508: J1.2 5.5,76.9 6.35,76.05 | U2.3 6.35,76.05 | 6.35,76.05 6.35,75.15 8.5,73 11,73 12.1,71.9 Q1.C
VCCIO
  Top 0.254: X2.8 27.5,51 27.5,52 29.25,53.75 39,53.75 39.25,53.5 39.25,53 | R15.1 39.25,53 | 39.25,53 R12.1 | D4.A J11.2 | R14.1 27.5,29.66 27.5,29.5 | C12.1 24.75,50.95
  Top 0.406: 27.1,50.9 X2.8 | J6.VCC 32.63,24.37 27.5,29.5 25.75,31.25 25.75,50.25 25.75,50.9 25.75,50.95
  Top 0.508: U4.5 24.75,50.95 25.75,50.95 27.45,50.95 27.5,51
  Bottom 0.406: J6.VCC 41.33,17.04 J11.2
VUSB  (via drill 0.4)
  Top 0.254: R4.2 5.27,71.41 D1.A | U4.3 17.7,49.05 17.25,49.5 v17.25,50.25 | 22.38,13.62 22.5,13.75 | C6.1 14.5,10 v15,10.5 | C11.1 18.5,50.95
  Top 0.406: J2.VBUS 26.3,83.25 26.3,82.8 26.25,82.75 | X1.VBUS 21.5,12.75 22.38,13.62 | 22.5,13.75 R5.2
  Top 0.508: U2.4 12.75,76.05 | 12.75,76.05 21.95,76.05 v22,76 | C2.1 12.75,76.05 | v4.25,73 4.25,72.89 D1.A 9.21,71.64 Q1.B | U4.1 18.5,50.95 17.95,50.95 v17.25,50.25
  Top 1.27: 26.3,83.25 26.3,76.3 v26,76 | v19,10.5 21.48,10.5 X1.VBUS
  Bottom 0.406: 7.25,69 7.5,69
  Bottom 0.508: v4.25,73 4.25,72 7.25,69 | 7.5,52 16.75,52 17.25,51.5 v17.25,50.25
  Bottom 1.27: X1.VBUS 11.23,10.52 7.5,14.25 7.5,52 7.5,69 14.5,76 v22,76 v24,76 v26,76
  other vias: 17,10.5
  pour Top: 21,77 27,77 27,75 21,75
  pour Bottom: 21,77 27,77 27,75 21,75
  pour Bottom: 14,11.25 22.25,11.25 22.25,9.75 14,9.75
  pour Top: 14,11.25 22.5,11.25 22.5,9.75 14,9.75

### Text on the board
_tsilk: J2 | FindMe Hub | J1 | C13 | U2 | R1 | C1 | C2 | R4 | D1 | U5 | C4 | Q1 | R2 | U1 | C5 | R9 | SWCLK | RST | SWDIO | SWO | R15 | J8 | R12 | C11 | C12 | U4 | C3 | U3 | R3 | C10 | X2 | Y1 | C9 | C8 | L1 | R6 | C7 | R16 | R8 | R14 | R7 | GND | SW2 | RST | nRF_TX | nRF_RX | 3V3 | SW1 | 3V3 | ESP_RX | G0 | ESP_TX | W | GND | R13 | D4 | R5 | D3 | B | R11 | C6 | X1 | R | R10 | D2